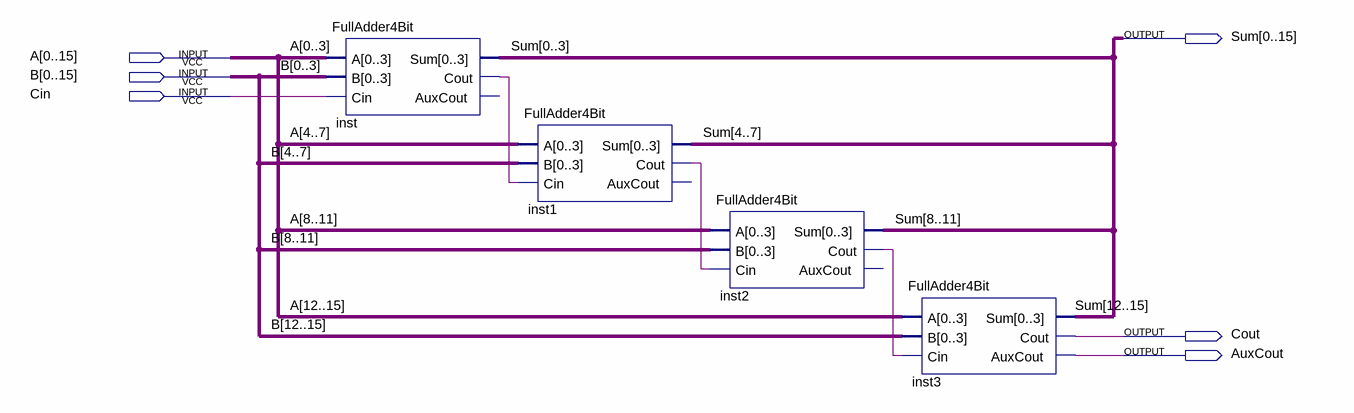
[diagram p0: schematic sheet]
// Quartus schematic FullAdder16Bit.bdf as structural Verilog: 4 symbols, 6 pins
module FullAdder16Bit (
  input  [0:15] A,
  input  [0:15] B,
  input  Cin,
  output [0:15] Sum,
  output Cout,
  output AuxCout
);

  wire inst1_cout, inst2_cout, inst_cout;

  FullAdder4Bit inst (.A(A[0:3]), .B(B[0:3]), .Cin(Cin), .Sum(Sum[0:3]), .Cout(inst_cout));  // open: AuxCout
  FullAdder4Bit inst1 (.A(A[4:7]), .B(B[4:7]), .Cin(inst_cout), .Sum(Sum[4:7]), .Cout(inst1_cout));  // open: AuxCout
  FullAdder4Bit inst2 (
    .A(A[8:11]), .B(B[8:11]), .Cin(inst1_cout), .Sum(Sum[8:11]), .Cout(inst2_cout));  // open: AuxCout
  FullAdder4Bit inst3 (.A(A[12:15]), .B(B[12:15]), .Cin(inst2_cout), .Sum(Sum[12:15]), .Cout(Cout), .AuxCout(AuxCout));
endmodule
